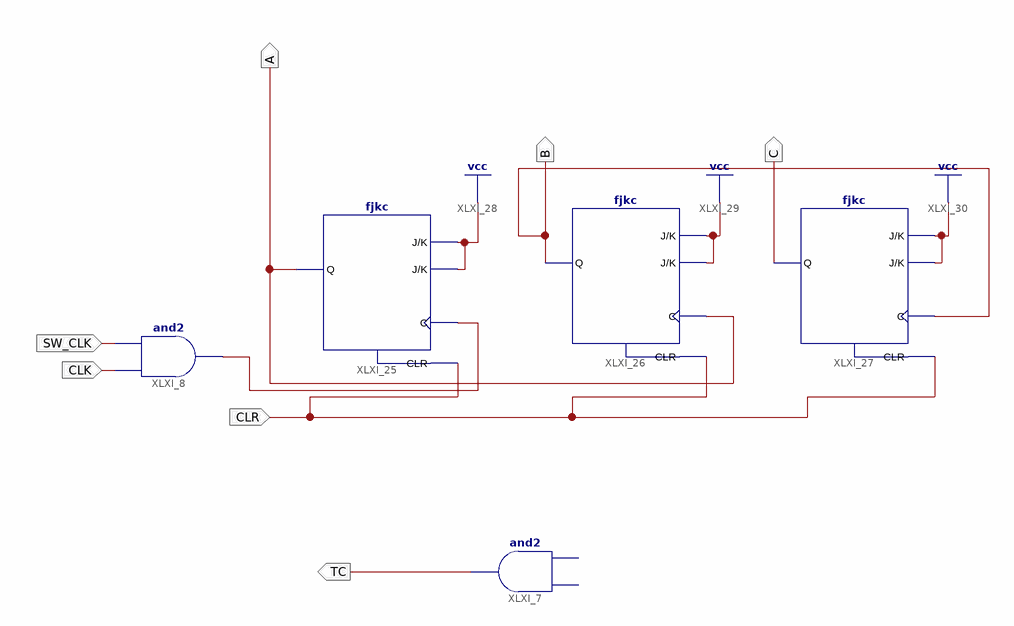
[diagram p0: schematic sheet 1]
// Xilinx ISE schematic Asyns.sch (spartan6) as structural Verilog: 5 symbols, 7 ports
module Asyns (
  input  CLR,
  input  SW_CLK,
  input  CLK,
  output TC,
  output A,
  output B,
  output C
);

  wire XLXN_62;

  and XLXI_8 (XLXN_62, CLK, SW_CLK);
  // and2 XLXI_7 has open pins: I0=open, I1=open, O=TC
  fjkc XLXI_25 (.C(XLXN_62), .CLR(CLR), .J(1'b1), .K(1'b1), .Q(A));
  fjkc XLXI_26 (.C(A), .CLR(CLR), .J(1'b1), .K(1'b1), .Q(B));
  fjkc XLXI_27 (.C(B), .CLR(CLR), .J(1'b1), .K(1'b1), .Q(C));
endmodule
